# Altium schematic sheet FPGA_Bypass_1V2.SCHDOC: FPGA Bypass 1V2
size A4; Organization: Altium Limited.; Address1: Level 3, 12a Rodborough Rd; Address2: Frenchs Forest 2086; Address3: NSW; Address4: AUSTRALIA; DocumentNumber: 17; Revision: 6; SheetNumber: 17; SheetTotal: 64; PageSetup: Record=PageOptions|CenterHorizontal=True|CenterVertical=True|PrintScale=0.97|XCorrection=1.00|YCorrection=1.00|PrintKind=0|BorderSize=5000000|LeftOffset=0|BottomOffset=0|Orientation=2|PaperLength=1000|PaperWidth=1000|Scale=100|PaperSource=7|PrintQuality=-4|MediaType=1|DitherType=10|PaperKind=A4 (210 x 297 mm)|PrintScaleMode=1
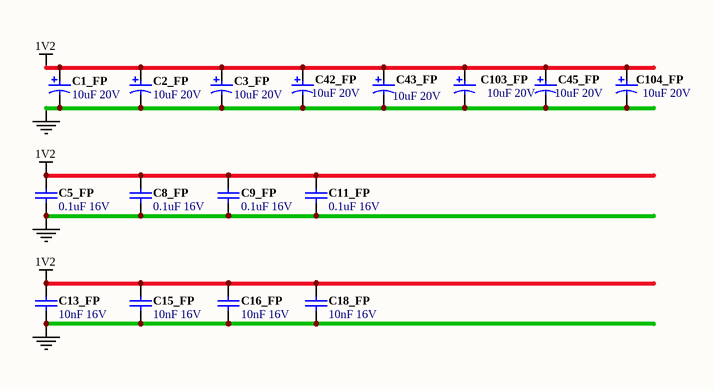
[diagram p0: FPGA_Bypass_1V2.SCHDOC]

## Parts
C1_FP  10uF 20V  [CAPC3528-STAR]
C2_FP  10uF 20V  [CAPC3528-STAR]
C3_FP  10uF 20V  [CAPC3528-STAR]
C5_FP  0.1uF 16V  [CAPC1005-STAR]
C8_FP  0.1uF 16V  [CAPC1005-STAR]
C9_FP  0.1uF 16V  [CAPC1005-STAR]
C11_FP  0.1uF 16V  [CAPC1005-STAR]
C13_FP  10nF 16V  [CAPC1005-STAR]
C15_FP  10nF 16V  [CAPC1005-STAR]
C16_FP  10nF 16V  [CAPC1005-STAR]
C18_FP  10nF 16V  [CAPC1005-STAR]
C42_FP  10uF 20V  [CAPC3528-STAR]
C43_FP  10uF 20V  [CAPC3528-STAR]
C45_FP  10uF 20V  [CAPC3528-STAR]
C103_FP  10uF 20V  [CAPC3528-STAR]
C104_FP  10uF 20V  [CAPC3528-STAR]

## Nets
1V2: C1_FP.1 C2_FP.1 C3_FP.1 C5_FP.1 C8_FP.1 C9_FP.1 C11_FP.1 C13_FP.1 C15_FP.1 C16_FP.1 C18_FP.1 C42_FP.1 C43_FP.1 C45_FP.1 C103_FP.1 C104_FP.1
GND: C1_FP.2 C2_FP.2 C3_FP.2 C5_FP.2 C8_FP.2 C9_FP.2 C11_FP.2 C13_FP.2 C15_FP.2 C16_FP.2 C18_FP.2 C42_FP.2 C43_FP.2 C45_FP.2 C103_FP.2 C104_FP.2

## Notes on the sheet
- Sheet Title
- Project Title
- Size:
- Date:
- A4
- Assy:
- Time:
- Sheet
- Revision:
- of
- File:

## Library data of the parts
C1_FP C2_FP C3_FP C42_FP C43_FP C45_FP C103_FP C104_FP = D-101-0007: Capacitor, Tantalum, 10uF 10% 20V MCCT-B (3528); Polarity: Polarized; Category: Capacitor; Capacitance: 10 uF; Mounting Technology: Surface Mount; Rated Voltage: 20 V; Status: Production; Technology: Tantalum; Tolerance: 10 %
C5_FP C8_FP C9_FP C11_FP = D-101-0080: Capacitor, Ceramic, 0.1uF 10% 16V 0402 (1005) X7R; Polarity: Non-Polarized; Category: Capacitor; Capacitance: 0.1 uF; Dielectric: X7R; Mounting Technology: Surface Mount; Rated Voltage: 16 V; Status: Production; Technology: Ceramic; Tolerance: 10 %
C13_FP C15_FP C16_FP C18_FP = D-101-0077: Capacitor, Ceramic, 10nF 10% 16V 0402 (1005) X7R; Polarity: Non-Polarized; Category: Capacitor; Capacitance: 10 nF; Dielectric: X7R; Mounting Technology: Surface Mount; Rated Voltage: 16 V; Status: Production; Technology: Ceramic; Tolerance: 10 %